# EAGLE schematic strip14 (EAGLE 8.0.2)
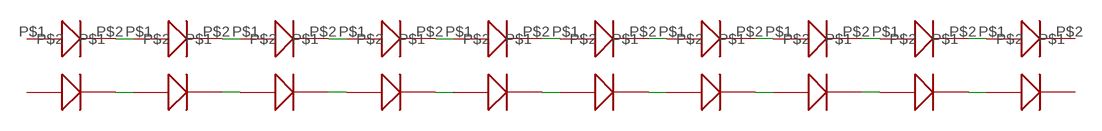
[diagram p0: schematic, sheet 1]

## Parts
U$1  JDSTS2.EM-HRHT-XX52-1  [JDSTS2.EM-HRHT-XX52-1]
U$2  JDSTS2.EM-HRHT-XX52-1  [JDSTS2.EM-HRHT-XX52-1]
U$3  JDSTS2.EM-HRHT-XX52-1  [JDSTS2.EM-HRHT-XX52-1]
U$4  JDSTS2.EM-HRHT-XX52-1  [JDSTS2.EM-HRHT-XX52-1]
U$5  JDSTS2.EM-HRHT-XX52-1  [JDSTS2.EM-HRHT-XX52-1]
U$6  JDSTS2.EM-HRHT-XX52-1  [JDSTS2.EM-HRHT-XX52-1]
U$7  JDSTS2.EM-HRHT-XX52-1  [JDSTS2.EM-HRHT-XX52-1]
U$8  JDSTS2.EM-HRHT-XX52-1  [JDSTS2.EM-HRHT-XX52-1]
U$9  JDSTS2.EM-HRHT-XX52-1  [JDSTS2.EM-HRHT-XX52-1]
U$10  JDSTS2.EM-HRHT-XX52-1  [JDSTS2.EM-HRHT-XX52-1]
U$11  BXEN-40E-11M-3A-00-0-0  [BXEN-40E-11M-3A-00-0-0]
U$12  BXEN-40E-11M-3A-00-0-0  [BXEN-40E-11M-3A-00-0-0]
U$13  BXEN-40E-11M-3A-00-0-0  [BXEN-40E-11M-3A-00-0-0]
U$14  BXEN-40E-11M-3A-00-0-0  [BXEN-40E-11M-3A-00-0-0]
U$15  BXEN-40E-11M-3A-00-0-0  [BXEN-40E-11M-3A-00-0-0]
U$16  BXEN-40E-11M-3A-00-0-0  [BXEN-40E-11M-3A-00-0-0]
U$17  BXEN-40E-11M-3A-00-0-0  [BXEN-40E-11M-3A-00-0-0]
U$18  BXEN-40E-11M-3A-00-0-0  [BXEN-40E-11M-3A-00-0-0]
U$19  BXEN-40E-11M-3A-00-0-0  [BXEN-40E-11M-3A-00-0-0]
U$20  BXEN-40E-11M-3A-00-0-0  [BXEN-40E-11M-3A-00-0-0]

## Nets
N$1: U$1.3V U$2.GND
N$2: U$2.3V U$3.GND
N$3: U$3.3V U$4.GND
N$4: U$4.3V U$5.GND
N$5: U$5.3V U$6.GND
N$6: U$6.3V U$7.GND
N$7: U$7.3V U$8.GND
N$8: U$8.3V U$9.GND
N$9: U$9.3V U$10.GND
N$10: U$19.P$2 U$20.P$1
N$11: U$18.P$2 U$19.P$1
N$12: U$17.P$2 U$18.P$1
N$13: U$16.P$2 U$17.P$1
N$14: U$15.P$2 U$16.P$1
N$15: U$11.P$2 U$12.P$1
N$16: U$12.P$2 U$13.P$1
N$17: U$13.P$2 U$14.P$1
N$18: U$14.P$2 U$15.P$1
Unconnected: U$1.GND U$10.3V U$11.P$1 U$20.P$2

## Library data of the parts
U$1-U$10 = Smile_Shade:JDSTS2.EM-HRHT-XX52-1
U$11-U$20 = Smile_Shade:BXEN-40E-11M-3A-00-0-0